# EAGLE design Buffer_1.2 (EAGLE 9.1.1)
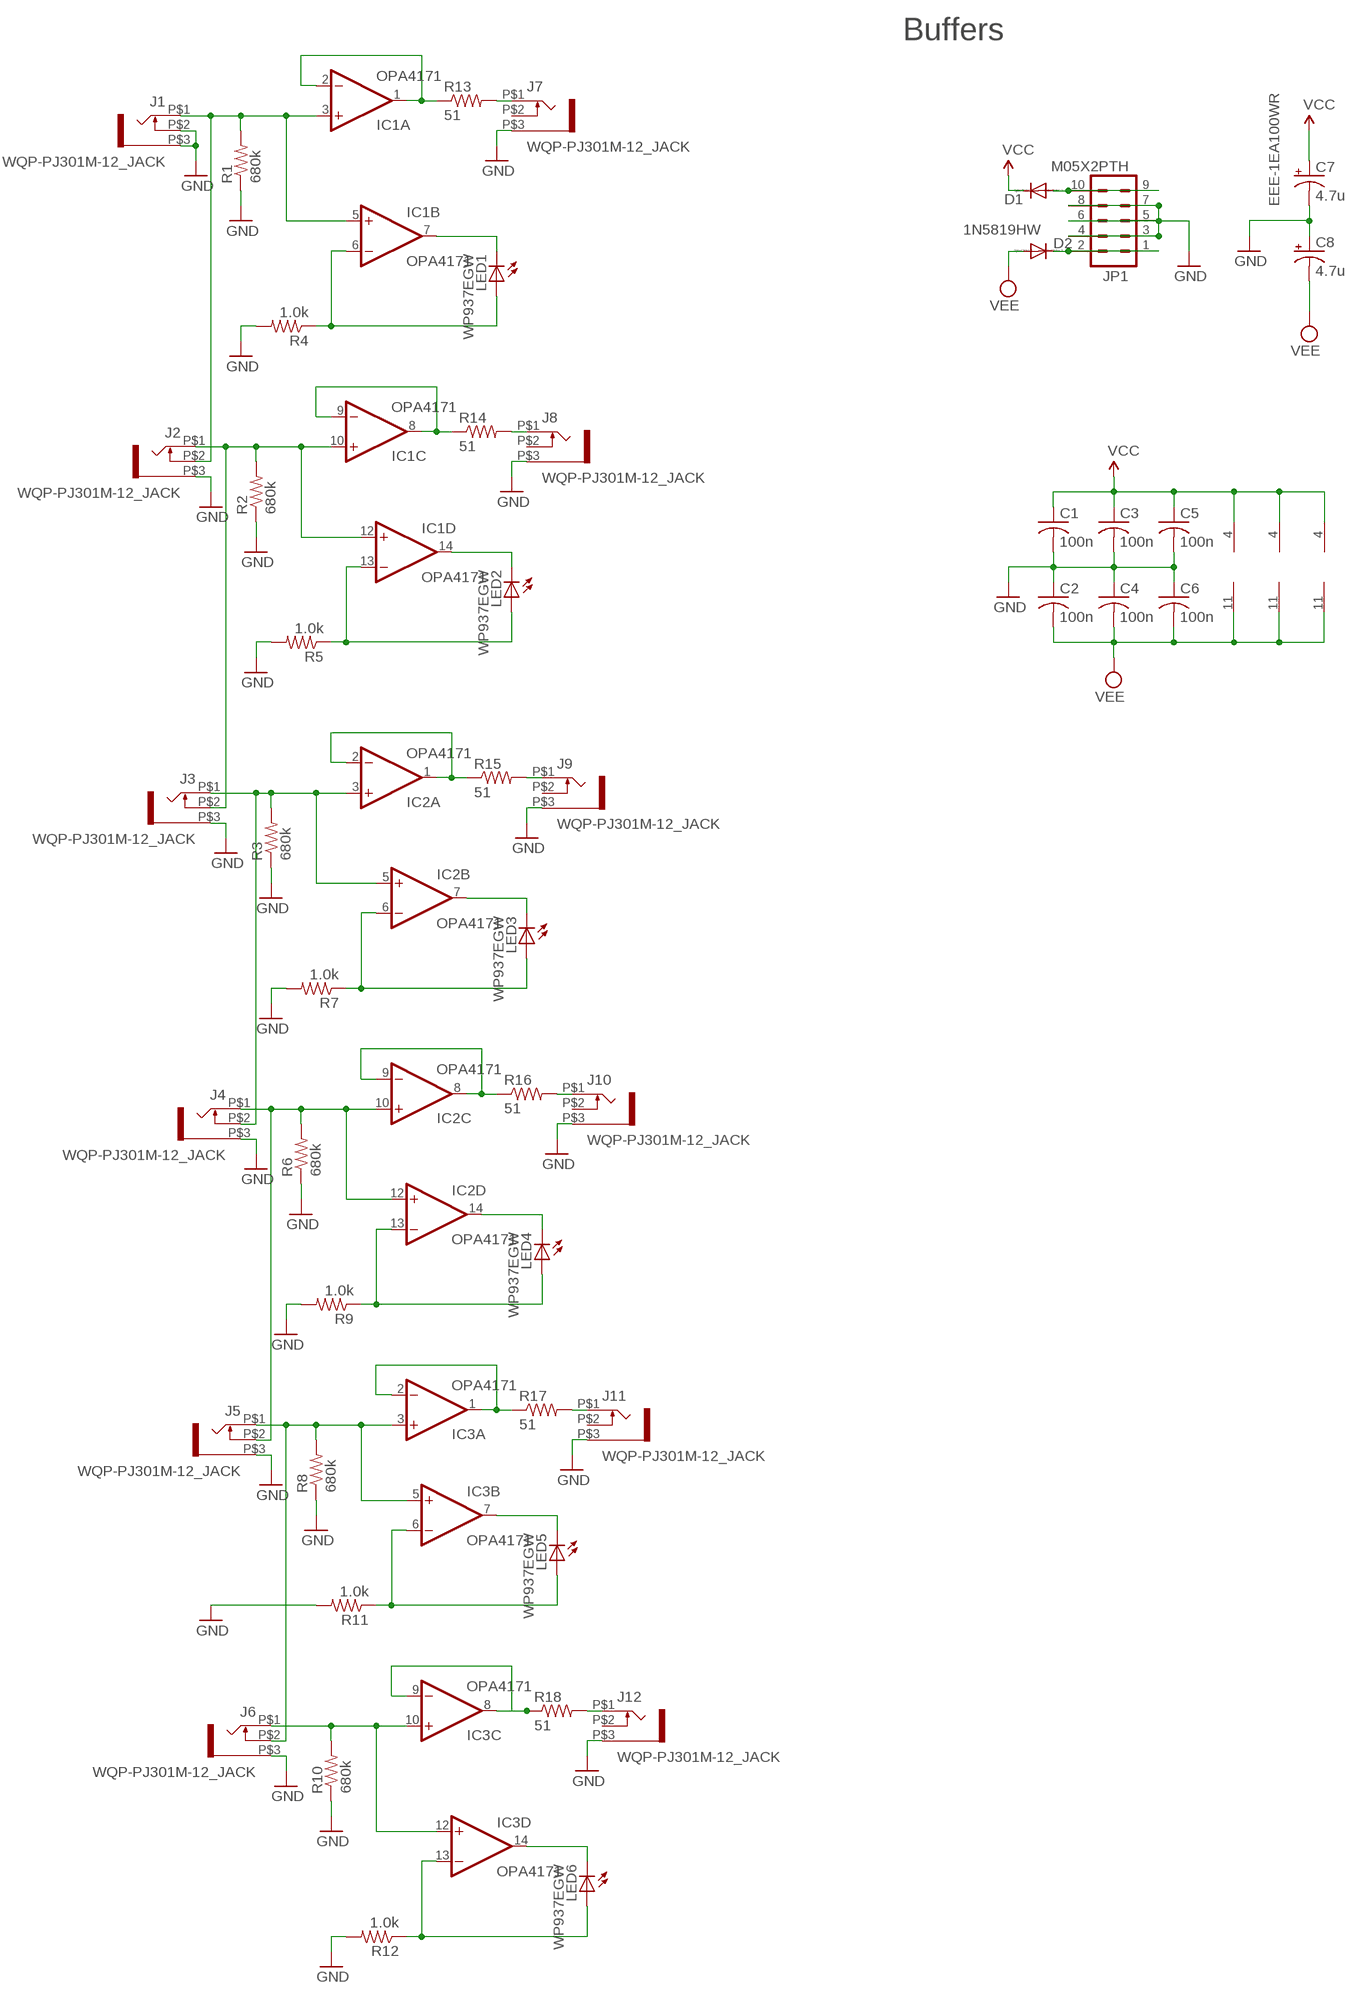
[diagram p0: schematic, sheet 1]

## Parts
C1  100n  C-USC0603  [C0603]
C2  100n  C-USC0603  [C0603]
C3  100n  C-USC0603  [C0603]
C4  100n  C-USC0603  [C0603]
C5  100n  C-USC0603  [C0603]
C6  100n  C-USC0603  [C0603]
C7  4.7u  CPOL-USA  [PANASONIC_A]
C8  4.7u  CPOL-USA  [PANASONIC_A]
D1  1N5819HW  DIODE-SOD123  [SOD123]
D2  1N5819HW  DIODE-SOD123  [SOD123]
IC1  OPA4171  TL074PW  [TSSOP14]
IC2  OPA4171  TL074PW  [TSSOP14]
IC3  OPA4171  TL074PW  [TSSOP14]
J1  WQP-PJ301M-12_JACK  [WQP-PJ301M-12_JACK]
J2  WQP-PJ301M-12_JACK  [WQP-PJ301M-12_JACK]
J3  WQP-PJ301M-12_JACK  [WQP-PJ301M-12_JACK]
J4  WQP-PJ301M-12_JACK  [WQP-PJ301M-12_JACK]
J5  WQP-PJ301M-12_JACK  [WQP-PJ301M-12_JACK]
J6  WQP-PJ301M-12_JACK  [WQP-PJ301M-12_JACK]
J7  WQP-PJ301M-12_JACK  [WQP-PJ301M-12_JACK]
J8  WQP-PJ301M-12_JACK  [WQP-PJ301M-12_JACK]
J9  WQP-PJ301M-12_JACK  [WQP-PJ301M-12_JACK]
J10  WQP-PJ301M-12_JACK  [WQP-PJ301M-12_JACK]
J11  WQP-PJ301M-12_JACK  [WQP-PJ301M-12_JACK]
J12  WQP-PJ301M-12_JACK  [WQP-PJ301M-12_JACK]
JP1  M05X2PTH  [AVR_ICSP]
LED1  WP937EGW  LED3MM  [LED3MM]
LED2  WP937EGW  LED3MM  [LED3MM]
LED3  WP937EGW  LED3MM  [LED3MM]
LED4  WP937EGW  LED3MM  [LED3MM]
LED5  WP937EGW  LED3MM  [LED3MM]
LED6  WP937EGW  LED3MM  [LED3MM]
R1  680k  R-US_R0603  [R0603]
R2  680k  R-US_R0603  [R0603]
R3  680k  R-US_R0603  [R0603]
R4  1.0k  R-US_R0603  [R0603]
R5  1.0k  R-US_R0603  [R0603]
R6  680k  R-US_R0603  [R0603]
R7  1.0k  R-US_R0603  [R0603]
R8  680k  R-US_R0603  [R0603]
R9  1.0k  R-US_R0603  [R0603]
R10  680k  R-US_R0603  [R0603]
R11  1.0k  R-US_R0603  [R0603]
R12  1.0k  R-US_R0603  [R0603]
R13  51  R-US_R0603  [R0603]
R14  51  R-US_R0603  [R0603]
R15  51  R-US_R0603  [R0603]
R16  51  R-US_R0603  [R0603]
R17  51  R-US_R0603  [R0603]
R18  51  R-US_R0603  [R0603]

## Nets
GND: C1.2 C2.1 C3.2 C4.1 C5.2 C6.1 C7.- C8.+ J1.P$2 J1.P$3 J2.P$3 J3.P$3 J4.P$3 J5.P$3 J6.P$3 J7.P$3 J8.P$3 J9.P$3 J10.P$3 J11.P$3 J12.P$3 JP1.3 JP1.4 JP1.5 JP1.6 JP1.7 JP1.8 R1.1 R2.1 R3.1 R4.2 R5.2 R6.1 R7.2 R8.1 R9.2 R10.1 R11.2 R12.2
N$1: IC1.3(A:+IN) IC1.5(B:+IN) J1.P$1 J2.P$2 R1.2
N$2: IC1.14(D:OUT) LED2.K(C)
N$3: IC1.1(A:OUT) IC1.2(A:-IN) R13.1
N$4: IC1.13(D:-IN) LED2.A R5.1
N$5: IC2.1(A:OUT) IC2.2(A:-IN) R15.1
N$6: D2.C JP1.1 JP1.2
N$7: J9.P$1 R15.2
N$8: IC1.7(B:OUT) LED1.K(C)
N$9: IC2.3(A:+IN) IC2.5(B:+IN) J3.P$1 J4.P$2 R3.2
N$10: J7.P$1 R13.2
N$11: J8.P$1 R14.2
N$12: IC2.8(C:OUT) IC2.9(C:-IN) R16.1
N$13: J10.P$1 R16.2
N$14: J11.P$1 R17.2
N$15: IC1.8(C:OUT) IC1.9(C:-IN) R14.1
N$16: IC2.10(C:+IN) IC2.12(D:+IN) J4.P$1 J5.P$2 R6.2
N$17: IC2.7(B:OUT) LED3.K(C)
N$18: J12.P$1 R18.2
N$19: IC2.6(B:-IN) LED3.A R7.1
N$20: D1.A JP1.9 JP1.10
N$21: IC1.6(B:-IN) LED1.A R4.1
N$22: IC1.10(C:+IN) IC1.12(D:+IN) J2.P$1 J3.P$2 R2.2
N$23: IC2.14(D:OUT) LED4.K(C)
N$24: IC2.13(D:-IN) LED4.A R9.1
N$25: IC3.1(A:OUT) IC3.2(A:-IN) R17.1
N$27: IC3.3(A:+IN) IC3.5(B:+IN) J5.P$1 J6.P$2 R8.2
N$30: IC3.8(C:OUT) IC3.9(C:-IN) R18.1
N$32: IC3.10(C:+IN) IC3.12(D:+IN) J6.P$1 R10.2
N$33: IC3.7(B:OUT) LED5.K(C)
N$34: IC3.6(B:-IN) LED5.A R11.1
N$35: IC3.14(D:OUT) LED6.K(C)
N$36: IC3.13(D:-IN) LED6.A R12.1
VCC: C1.1 C3.1 C5.1 C7.+ D1.C IC1.4(P:V+) IC2.4(P:V+) IC3.4(P:V+)
VEE: C2.2 C4.2 C6.2 C8.- D2.A IC1.11(P:V-) IC2.11(P:V-) IC3.11(P:V-)
Unconnected: J7.P$2 J8.P$2 J9.P$2 J10.P$2 J11.P$2 J12.P$2

## Notes on the sheet
- Buffers
- EEE-1EA100WR

## Library data of the parts
C1-C6 = rcl:C-US: CAPACITOR, American symbol; SPICEPREFIX: C
C7 C8 = rcl:CPOL-US: POLARIZED CAPACITOR, American symbol; SPICEPREFIX: C
D1 D2 = diode:DIODE-: DIODE
IC1-IC3 = linear:TL074: OP AMP
J1-J12 = thonkiconn 3:WQP-PJ301M-12_JACK
JP1 = og-header:M05X2: Header 5x2 Standard 10-pin dual row 0.1" header. Commonly used with AVR-ISP. Use with Spark Fun Electronics SKU: PRT-00778
LED1-LED6 = led:LED: LED OSRAM: - CHIPLED LG R971, LG N971, LY N971, LG Q971, LY Q971, LO R971, LY R971 LH N974, LH R974 LS Q976, LO Q976, LY Q976 LO Q996 - Hyper CHIPLED LW Q18S LB Q993, LB Q99A, LB R99A - SideLED LS A670, LO A670, LY A670, LG A670, LP A670 LB A673, LV A673, LT A673, LW A673 LH A674 LY A675 LS A676, LA A676, LO A676, LY A676, LW A676 LS A679, LY A679, LG A679 - Hyper Micro SIDELED® LS Y876, LA Y876, LO Y876, LY Y876 LT Y87S - SmartLED LW L88C, LW L88S LB L89C, LB L89S, LG L890 LS L89K, LO L89K, LY L89K LS L896, LA L896, LO L896, LY L896 - TOPLED LS T670, LO T670, LY T670, LG T670, LP T670 LSG T670, LSP T670, LSY T670, LOP T670, LYG T670 LG T671, LOG T671, LSG T671 LB T673, LV T673, LT T673, LW T673 LH T674 LS T676, LA T676, LO T676, LY T676, LB T676, LH T676, LSB T676, LW T676 LB T67C, LV T67C, LT T67C, LS T67K, LO T67K, LY T67K, LW E67C LS E67B, LA E67B, LO E67B, LY E67B, LB E67C, LV E67C, LT E67C LW T67C LS T679, LY T679, LG T679 LS T770, LO T770, LY T770, LG T770, LP T770 LB T773, LV T773, LT T773, LW T773 LH T774 LS E675, LA E675, LY E675, LS T675 LS T776, LA T776, LO T776, LY T776, LB T776 LHGB T686 LT T68C, LB T68C - Hyper Mini TOPLED® LB M676 - Mini TOPLED Santana® LG M470 LS M47K, LO M47K, LY M47K Source: http://www.osram.convergy.de LUXEON: - LUMILED® LXK2-PW12-R00, LXK2-PW12-S00, LXK2-PW14-U00, LXK2-PW14-V00 LXK2-PM12-R00, LXK2-PM12-S00, LXK2-PM14-U00 LXK2-PE12-Q00, LXK2-PE12-R00, LXK2-PE12-S00, LXK2-PE14-T00, LXK2-PE14-U00 LXK2-PB12-K00, LXK2-PB12-L00, LXK2-PB12-M00, LXK2-PB14-N00, LXK2-PB14-P00, LXK2-PB14-Q00 LXK2-PR12-L00, LXK2-PR12-M00, LXK2-PR14-Q00, LXK2-PR14-R00 LXK2-PD12-Q00, LXK2-PD12-R00, LXK2-PD12-S00 LXK2-PH12-R00, LXK2-PH12-S00 LXK2-PL12-P00, LXK2-PL12-Q00, LXK2-PL12-R00 Source: www.luxeon.com KINGBRIGHT: KA-3528ASYC Source: www.kingbright.com
R1-R3 R6 R8 R10 R13-R18 = resistor:R-US_: RESISTOR, American symbol
R4 R5 R7 R9 R11 R12 = rcl:R-US_: RESISTOR, American symbol; SPICEPREFIX: R

## Board
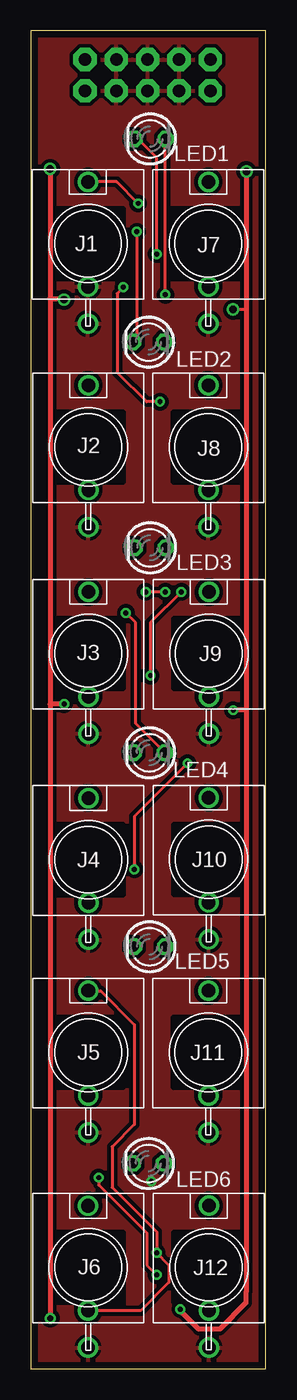
[diagram p1: board, top side]
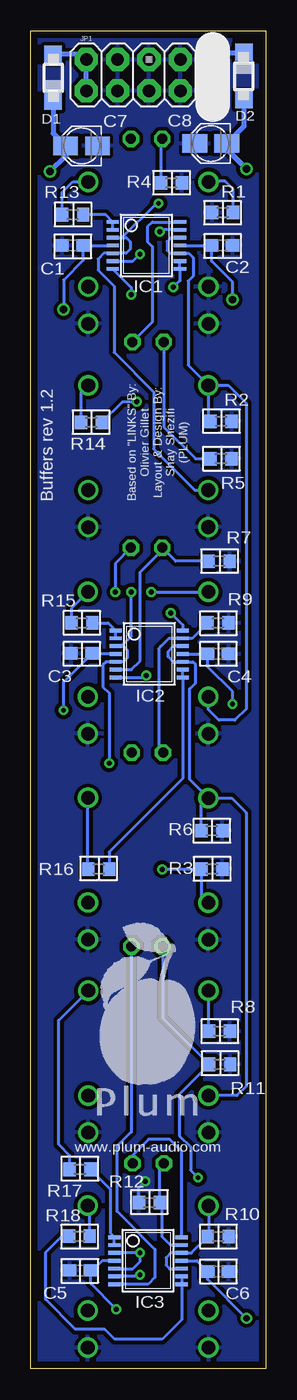
[diagram p2: board, bottom side, seen from below]

Size 19.05 x 108.5 mm. Coordinates in mm from the lower left corner, seen from the top.
Outline: 0,0 19.05,0 19.05,108.5 0,108.5 0,0
Copper layers (1*16): Top 0.035mm / dielectric 1.5mm / Bottom 0.035mm
Design rules "default *": minimum track width 6mil, minimum drill 0.35mm, track to track 12mil, track to pad 6mil, pad to pad 6mil, via to via 6mil, smd to smd 6mil, copper to edge 20mil, drill to drill 6mil, minimum pad ring 10mil, minimum via ring 8mil, stop-mask expansion 4mil, vias tented up to drill 25mil, thermal gap 10mil

### Footprints (pad centres in the part's own frame; a part is rotated, then mirrored left to right if it is on the bottom)
C0603 = smd 1.1 x 1: 1 -0.85,0; 2 0.85,0
PANASONIC_A = smd 2 x 1.5: + 1.3,0; - -1.3,0
SOD123 = smd 1.4 x 1.4: A 1.9,0; C -1.9,0
TSSOP14 = smd 0.305 x 0.991: 1 -1.905,-2.718; 2 -1.27,-2.718; 3 -0.635,-2.718; 4 0,-2.718; 5 0.635,-2.718; 6 1.27,-2.718; 7 1.905,-2.718; 8 1.905,2.718; 9 1.27,2.718; 10 0.635,2.718; 11 0,2.718; 12 -0.635,2.718; 13 -1.27,2.718; 14 -1.905,2.718
WQP-PJ301M-12_JACK = drill 1.1: P$1 0,5; P$2 0,-3.5; P$3 0,-6.5
AVR_ICSP = drill 1.016 pad 1.88 octagon: 1 -1.27,5.08; 2 1.27,5.08; 3 -1.27,2.54; 4 1.27,2.54; 5 -1.27,0; 6 1.27,0; 7 -1.27,-2.54; 8 1.27,-2.54; 9 -1.27,-5.08; 10 1.27,-5.08
LED3MM = drill 0.813 octagon: A -1.27,0; K 1.27,0
R0603 = smd 1 x 1.1: 1 -0.85,0; 2 0.85,0

### Placement (x,y rotation side)
C1  15.67,91.09 180 bottom
C2  3.54,91.1 180 bottom
C3  14.94,58.01 180 bottom
C4  3.86,57.98 180 bottom
C5  15.06,7.97 180 bottom
C6  3.86,7.88 180 bottom
C7  14.93,99.17 180 bottom
C8  4.46,99.36 180 bottom
D1  17.25,104.69 90 bottom
D2  1.78,104.83 270 bottom
IC1  9.68,91.09 270 bottom
IC2  9.45,57.96 270 bottom
IC3  9.55,8.76 270 bottom
J1  4.63,91.25 0 top
J2  4.66,74.76 0 top
J3  4.66,58 0 top
J4  4.66,41.28 0 top
J5  4.65,25.65 0 top
J6  4.65,8.21 0 top
J7  14.4,91.25 0 top
J8  14.4,74.75 0 top
J9  14.43,58 0 top
J10  14.42,41.31 0 top
J11  14.4,25.65 0 top
J12  14.44,8.21 0 top
JP1  9.47,104.9 270 bottom
LED1  9.66,99.74 0 top
LED2  9.54,83.26 0 top
LED3  9.66,66.58 0 top
LED4  9.6,49.96 0 top
LED5  9.63,34.23 0 top
LED6  9.53,16.65 0 top
R1  3.5,93.76 0 bottom
R2  3.62,76.84 180 bottom
R3  4.37,40.52 180 bottom
R4  7.66,96.17 0 bottom
R5  3.63,73.8 0 bottom
R6  4.37,43.64 180 bottom
R7  3.78,65.49 0 bottom
R8  3.76,27.37 180 bottom
R9  3.87,60.48 0 bottom
R10  3.85,10.71 180 bottom
R11  3.73,24.68 0 bottom
R12  9.43,13.47 180 bottom
R13  15.65,93.59 180 bottom
R14  14.14,76.75 180 bottom
R15  14.92,60.48 180 bottom
R16  13.54,40.52 180 bottom
R17  15.07,16.17 180 bottom
R18  15.12,10.74 0 bottom

### Tracks (layer width: path | path; a pad name or v marks a point on that pad's centre or on a via)
GND  (via drill 0.4)
  Bottom 0.254: R12.2 10.28,14.66 v9.76,15.18
  pour Top (isolate 0.254): -1,109 20,109 20,-1 -1,-1
  pour Bottom (isolate 0.1): 20,109 20,-1 -1,-1 -1,109
N$1  (via drill 0.4)
  Top 0.254: v8.7,94.5 6.95,96.25 J1.P$1
  Bottom 0.254: R1.2 2.65,95.65 3.3,96.3 4.58,96.3 J1.P$1 | v8.7,94.5 8.9,94.5 11.67,91.73 IC1.3 11.33,91.73 11,91.4 11,90.77 11.32,90.46 IC1.5 13.14,90.46 13.6,90 13.6,89.1 12.29,87.79 12.29,82.42 9.09,79.22 9.09,74.58 5.77,71.26 J2.P$2
N$2
  Bottom 0.254: IC1.14 9.2,93 9.6,92.6 9.6,91.4 9.2,91 9.2,84.88 LED2.K
N$3
  Bottom 0.254: IC1.2 IC1.1 12.99,93.59 R13.1
N$4  (via drill 0.4)
  Top 0.254: LED2.A 8.6,83.59 v8.6,92.2
  Bottom 0.254: LED2.A 8.27,76.37 5.7,73.8 R5.1 | IC1.13 8.44,92.36 v8.6,92.2
N$5
  Bottom 0.254: IC2.2 IC2.1 12.78,60.48 R15.1
N$6
  Bottom 0.406: JP1.2 JP1.1 3.83,106.73 D2.C
N$7
  Bottom 0.254: J9.P$1 15.77,61.67 R15.2
N$8  (via drill 0.4)
  Top 0.254: v10.9,87.1 10.9,99.71 LED1.K
  Bottom 0.254: IC1.7 10.9,87.68 v10.9,87.1
N$9  (via drill 0.4)
  Top 0.254: v12.7,49.1 8.4,44.8 v8.4,40.5 | v10.9,63 v9.3,63
  Bottom 0.254: v12.7,49.1 12.7,54.8 13.2,55.3 13.2,57.1 12.97,57.33 IC2.5 11.52,57.33 11.52,57.37 11.24,57.65 11.24,58.28 11.56,58.6 IC2.3 11.7,58.6 11.58,58.72 10.9,59.4 v10.9,63 | v8.4,40.5 8.38,40.52 R3.2 5.22,38.33 J4.P$2 | v9.3,63 J3.P$1
N$10
  Bottom 0.254: R13.2 16.5,95.4 15.65,96.25 J7.P$1
N$11
  Bottom 0.254: J8.P$1 14.99,79.16 R14.2
N$12
  Bottom 0.254: IC2.9 IC2.8 6.73,47.87 6.96,47.65 | R16.1 12.69,41.91 6.96,47.65 | 6.86,47.74 6.96,47.65
N$13
  Bottom 0.254: R16.2 14.42,40.55 J10.P$1
N$14
  Bottom 0.254: J11.P$1 16.8,28.25 16.8,18.2 15.92,17.32 R17.2
N$15  (via drill 0.4)
  Top 0.254: v7.5,87.7 7,87.2 7,80.8 9.38,78.42 v10.47,78.42
  Bottom 0.254: IC1.9 IC1.8 6.97,88.23 v7.5,87.7 | R14.1 11.62,78.42 v10.47,78.42
N$16
  Bottom 0.254: R6.2 5.22,45.72 J4.P$1 | J4.P$1 2.78,46.28 1.6,45.1 1.6,22.9 2.35,22.15 J5.P$2 | IC2.12 7.49,58.6 7.93,58.16 7.93,57.74 7.52,57.33 IC2.10 5.93,57.33 5.7,57.1 5.7,55.6 6.17,55.13 6.17,47.78 J4.P$1
N$17  (via drill 0.4)
  Top 0.254: v12.2,63 9.7,60.5 v9.7,56.2
  Bottom 0.254: LED3.K 12.2,65.31 v12.2,63 | IC2.7 9.84,56.06 v9.7,56.2
N$18
  Bottom 0.254: R18.2 14.27,13.04 J12.P$1
N$19
  Bottom 0.254: R7.1 7.3,65.49 LED3.A 8.39,66.41 10.2,64.6 10.2,57.4 10.91,56.69 IC2.6
N$20
  Bottom 0.406: JP1.10 JP1.9 14.97,106.59 D1.A
N$21  (via drill 0.4)
  Top 0.254: LED1.A 8.66,99.74 10.2,98.2 v10.2,90.4
  Bottom 0.254: LED1.A 8.51,99.63 R4.1 | IC1.6 10.78,89.82 v10.2,90.4
N$22
  Bottom 0.254: J2.P$1 6.3,81.39 6.3,88.2 5.9,88.6 5.9,90.1 6.26,90.46 IC1.10 7.76,90.46 7.99,90.69 7.99,91.41 7.67,91.73 IC1.12 | J2.P$1 4.66,77.03 R2.2 | J2.P$1 3.06,79.76 1.6,78.3 1.6,53.5 2.5,52.6 3.8,52.6 4.66,53.46 J3.P$2
N$23  (via drill 0.4)
  Top 0.254: LED4.K 8.5,52.33 8.5,60.5 v7.7,61.3
  Bottom 0.254: v7.7,61.3 6.73,60.33 IC2.14
N$24
  Bottom 0.254: R9.1 5.97,59.23 IC2.13 7.87,59.23 8.52,58.58 | 8.52,58.58 8.7,58.4 | 8.7,58.4 8.7,50.33 LED4.A | 8.52,58.58 8.7,58.4
N$25
  Bottom 0.254: IC3.2 IC3.1 12.61,11 12.61,14.56 R17.1
N$27  (via drill 0.4)
  Top 0.254: J5.P$1 5.65,30.65 8.4,27.9 8.4,19.8 6.6,18 6.6,14.7 10.2,11.1 v10.2,9.4 11.2,8.4 11.2,7 8.91,4.71 J6.P$2
  Bottom 0.254: J5.P$1 4.65,27.41 R8.2 | IC3.3 v10.21,9.39 v10.2,9.4 10.2,8.7 10.78,8.12 IC3.5
N$30
  Bottom 0.254: IC3.9 IC3.8 6.83,3.97 8.4,2.4 12.26,2.4 13.07,3.21 15.45,3.21 17.86,5.62 17.86,9.42 16.53,10.74 R18.1
N$32
  Bottom 0.254: J6.P$1 4.64,10.77 R10.2 6.03,9.39 IC3.12 7.69,9.39 8.08,9 8.08,8.39 7.79,8.1 7.77,8.12 IC3.10
N$33
  Bottom 0.254: LED5.K 10.9,19.2 11.67,18.43 12.05,18.05 12.05,12.75 9,9.7 9,7.4 9.55,6.85 9.7,6.85 IC3.7
N$34  (via drill 0.4)
  Top 0.254: v5.5,15.5 5.5,14.9 9.4,11 9.4,8.4 v10.2,7.6
  Bottom 0.254: LED5.A 8.36,28.46 R11.1 7,22.26 7,18.9 6.1,18 6.1,16.1 v5.5,15.5 | v10.2,7.6 10.31,7.49 IC3.6
N$35
  Bottom 0.254: IC3.14 6.83,17.63 7.8,18.6 9.5,18.6 10.8,17.3 LED6.K
N$36
  Bottom 0.254: IC3.13 7.72,10.03 8.4,10.7 8.4,13.29 R12.1 8.58,16.32 LED6.A
VCC  (via drill 0.4, 0.6)
  Top 0.254: 17.48,85.9 v16.4,85.9
  Top 0.406: v17.48,97.1 17.48,85.9 17.48,53.3 | v16.4,53.4 17.38,53.4 17.48,53.3 | 17.48,53.3 17.48,6.26 17.44,6.22 17.44,5.33 15.32,3.21 13.6,3.21 12.12,4.69 v12.12,4.82
  Bottom 0.254: v16.4,53.4 16.4,55.7 C3.1 14.04,57.96 IC2.4 | IC3.4 13.26,8.76 14.21,7.8 C5.1 14.21,6.91 v12.12,4.82 | IC1.4 C1.1 14.8,91.07 14.8,89.9 16.4,88.3 v16.4,85.9
  Bottom 0.406: D1.C 17.25,100.18 C7.+ 16.23,98.35 v17.48,97.1
VEE  (via drill 0.4, 0.5, 0.6)
  Top 0.406: v1.57,97.3 1.57,86.8 | 1.57,86.8 1.57,53.9 | 1.57,53.9 v1.57,4.1 | 1.57,86.8 2.6,86.8 v2.7,86.7 | v2.7,53.9 1.57,53.9
  Bottom 0.254: v1.57,4.1 4.71,7.24 C6.2 5.58,8.76 IC3.11 | v2.7,53.9 2.7,54.9 4.71,56.91 C4.2 4.73,57.96 IC2.11 | v2.7,86.7 2.7,88.1 4.4,89.8 4.4,91.09 | 4.4,91.09 C2.2 | IC1.11 4.4,91.09
  Bottom 0.406: D2.A 1.77,100.75 C8.- 3.16,98.89 v1.57,97.3

### Text on the board
bPlace: Based on "LINKS" By: / Olivier Gillet / Layout & Design By: / Shay Shezifi / (PLUM) | Buffers rev 1.2 | www.plum-audio.com